# Altium schematic sheet USB.SchDoc: USB Device
size A4; SheetSize: A4
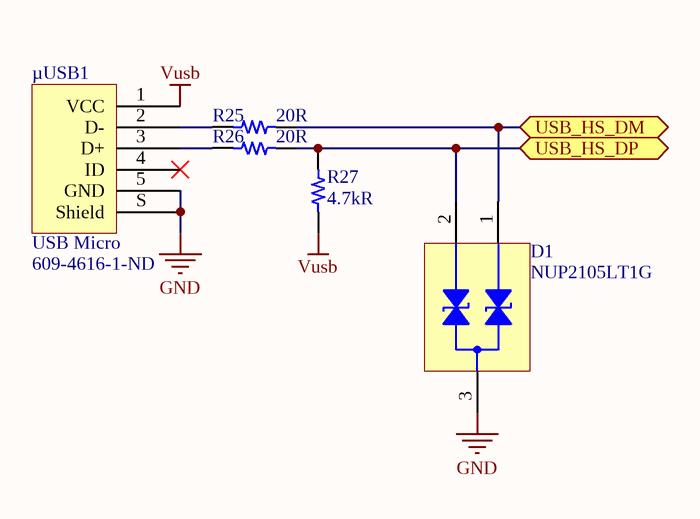
[diagram p0: USB.SchDoc]

## Parts
D1  NUP2105LT1G  [ON SEMI SOT-23-3]  (no BOM)
R25  20R  [RES 0603/1608]
R26  20R  [RES 0603/1608]
R27  4.7kR  [RES 0603/1608]
µUSB1  USB Micro  Supplier Part Number 1: 609-4616-1-ND  [FCI USB 10118193-0001LF]

## Ports
USB_HS_DM (bidir), USB_HS_DP (bidir)

## Nets
GND: D1.3(I/O_2) µUSB1.5(GND) µUSB1.S(Shield)
Vusb: R27.1 µUSB1.1(VCC)
USB_HS_DM: D1.1(I/O_1) R25.1 ; port USB_HS_DM
USB_HS_DP: D1.2(GND) R26.1 R27.2 ; port USB_HS_DP
NetR25_2: R25.2 µUSB1.2(D-)
NetR26_2: R26.2 µUSB1.3(D+)

Not connected (* = marked no-connect by the designer): µUSB1 4(ID)*

## Notes on the sheet
- Title:
- Size:
- Project:
- Revision:
- Sheet
- of
- Date:
- YıLDıZ IoT
- Elperek Mahallesi
- Saray Sokak, No:12
- SAKARYA / TURKEY
- File:

## Library data of the parts
D1 = NUP2105LT1G: TVS DIODE 24V 44V SOT23-3; Manufacturer: ON Semiconductor; Bidirectional Channels: 2; Capacitance @ Frequency: 30pF @ 1MHz; Current - Peak Pulse (10/1000µs): 8A (8/20µs); Power Line Protection: No; Power - Peak Pulse: 350W; Type: Zener; Voltage - Breakdown (Min): 26.2V; Voltage - Reverse Standoff (Typ): 24V (Min); Manufacturer Part Number: NUP2105LT1G; Applications: General Purpose; ComponentLink1Description: Datasheet; ComponentLink1URL: http://www.onsemi.com/pub/Collateral/NUP2105L-D.PDF; ComponentLink2Description: DigiKey Link; ComponentLink2URL: http://digikey.com/product-detail/en/on-semiconductor/NUP2105LT1G/NUP2105LT1GOSCT-ND/1485001; Device Package: TO-236-3, SC-59, SOT-23-3; LastUpdated: 30.03.2020 16:33:57; Lifecycle Status: Active; Minimum Order: 1; Mounting Type: Surface Mount; Operating Temperature: -55°C ~ 150°C (TJ); Package / Case: TO-236-3, SC-59, SOT-23-3; Packaging: TapeAndReel; PartId: 10506; Part Status: Active; Price: 0.09; Series: -; Supplier 1: DigiKey; Supplier Part Number 1: NUP2105LT1GOSCT-ND; Supplier Device Package: SOT-23-3 (TO-236); Voltage - Clamping (Max) @ Ipp: 44V
R25 R26 = Resistor_Chip: Ceramic, SMT Capacitor; Manufacturer: Panasonic; Manufacturer Part Number: ERJ3EKF20R0V; Power Rating: 100mW; Tolerance: 1%; Voltage Rating: 75V; Temperature Coefficient: 100ppm/°C; Voltage Rating (DC): 50V; Supplier 1: Digi-Key; Supplier Part Number 1: P20.0HCT-ND; Stock 1: 1013618; Pricing 1: 1 = 0,10000, 10 = 0,06500, 100 = 0,02640, 1000 = 0,01186, 2500 = 0,01029 (USD); RoHS: Yes; Mount: Surface Mount; Case/Package: 0603; Case Code (Metric): 1608; Case Code (Imperial): 0603; Contact Plating: Tin; Min Operating Temperature: -55°C; Max Operating Temperature: 155°C; Packaging: Tape and Reel; Resistance: 20R; Package Quantity: 1; Composition: Thick Film; Number of Terminations: 2; Termination: SMD/SMT; Military Standard: Not; Max Power Dissipation: 100mW; Features: Automotive AEC-Q200; Length: 1.6mm; Height: 0.45mm; Width: 0.031inch; Depth: 0.8mm; Radiation Hardening: No; REACH SVHC: No SVHC; Lead Free: Lead Free; ComponentLink1URL: http://industrial.panasonic.com/www-data/pdf/AOA0000/AOA0000CE2.pdf; ComponentLink1Description: http://industrial.panasonic.com/www-data/pdf/AOA0000/AOA0000CE2.pdf; ComponentLink2URL: https://www.alliedelec.com/m/d/623f45ff1957d936ff56d46fd1c28cac.pdf; ComponentLink2Description: https://www.alliedelec.com/m/d/623f45ff1957d936ff56d46fd1c28cac.pdf; ComponentLink3URL: http://www.jameco.com/Jameco/Products/ProdDS/1987732.pdf; ComponentLink3Description: http://www.jameco.com/Jameco/Products/ProdDS/1987732.pdf; ComponentLink4URL: http://www.farnell.com/datasheets/1678782.pdf; ComponentLink4Description: http://www.farnell.com/datasheets/1678782.pdf; ComponentLink5URL: http://www.farnell.com/datasheets/1911175.pdf; ComponentLink5Description: http://www.farnell.com/datasheets/1911175.pdf; ComponentLink6URL: http://www.mouser.com/ds/2/315/AOA0000CE2-37512.pdf; ComponentLink6Description: http://www.mouser.com/ds/2/315/AOA0000CE2-37512.pdf
R27 = Resistor_Chip: Ceramic, SMT Capacitor; Manufacturer: Yageo Phycomp; Manufacturer Part Number: RC0603FR-074K7L; Tolerance: 1%; Temperature Coefficient: 100ppm/°C; Voltage Rating (DC): 50V; Power Rating: 100mW; Supplier 1: Digi-Key; Supplier Part Number 1: 311-4.70KHRCT-ND; Stock 1: 21621510; Pricing 1: 1 = 0,10000, 10 = 0,02400, 100 = 0,00970, 1000 = 0,00437, 2500 = 0,00379 (USD); RoHS: Yes; Mount: Surface Mount; Case/Package: 0603; Number of Pins: 2; Min Operating Temperature: -55°C; Max Operating Temperature: 155°C; Packaging: Cut Tape; Resistance: 4.7kR; Length: 1.6mm; Height: 0.45mm; Width: 800um; Depth: 0.8mm; REACH SVHC: No SVHC; Lead Free: Lead Free
µUSB1 = USB 2.0 Type B Micro: Manufacturer: Amphenol FCI; Manufacturer Part Number: 10118193-0001LF; Gender: Female; Current Rating: 1.8A; Number of Contacts: 5; Number of Ports: 1; Connector Type: USB,Receptacle; Insulation Resistance: 1GR; Max Voltage Rating (AC): 100V; Pitch: 0.65mm; Supplier 1: Digi-Key; Stock 1: 57004; Pricing 1: 1 = 0,43000, 10 = 0,40500, 25 = 0,36480, 50 = 0,32420, 100 = 0,31070, 250 = 0,28368, 500 = 0,27016 (USD); RoHS: Yes; Mount: Surface Mount,Horizontal; Contact Plating: Gold; Housing Material: Polymer; Contact Material: Copper Alloy; Number of Terminals: 5; Color: Black; Min Operating Temperature: -55°C; Max Operating Temperature: 85°C; Packaging: Tape and Reel; Termination: Solder; Package Quantity: 1200; Orientation: Right Angle; Voltage Rating: 100V; Features: Shielded; Length: 7.86mm; Depth: 5.67mm; Radiation Hardening: No; Flammability Rating: UL94 V-0; ComponentLink1URL: https://datasheet.ciiva.com/14802/10118193-0001lf-webpage-14802386.pdf?src-supplier=Arrow; ComponentLink1Description: https://datasheet.ciiva.com/14802/10118193-0001lf-webpage-14802386.pdf?src-supplier=Arrow; ComponentLink2URL: https://datasheet.ciiva.com/851/10118193-851106.pdf?src-supplier=Digi-Key; ComponentLink2Description: https://datasheet.ciiva.com/851/10118193-851106.pdf?src-supplier=Digi-Key; ComponentLink3URL: https://datasheet.ciiva.com/26853/getdatasheetpartid-418618-26853893.pdf?src-supplier=Verical; ComponentLink3Description: https://datasheet.ciiva.com/26853/getdatasheetpartid-418618-26853893.pdf?src-supplier=Verical; ComponentLink4URL: https://datasheet.ciiva.com/4598/10118193ac-197151-4598799.pdf?src-supplier=Mouser; ComponentLink4Description: https://datasheet.ciiva.com/4598/10118193ac-197151-4598799.pdf?src-supplier=Mouser; ComponentLink5URL: https://datasheet.ciiva.com/851/10118193-851108.pdf?src-supplier=Digi-Key; ComponentLink5Description: https://datasheet.ciiva.com/851/10118193-851108.pdf?src-supplier=Digi-Key; ComponentLink6URL: https://datasheet.ciiva.com/14618/70236827-14618887.pdf?src-supplier=Allied+Electronics; ComponentLink6Description: https://datasheet.ciiva.com/14618/70236827-14618887.pdf?src-supplier=Allied+Electronics; ComponentLink7URL: https://datasheet.ciiva.com/851/10118193-851107.pdf?src-supplier=Digi-Key; ComponentLink7Description: https://datasheet.ciiva.com/851/10118193-851107.pdf?src-supplier=Digi-Key